# Altium schematic sheet UWB_DWM1000.SchDoc
size A4
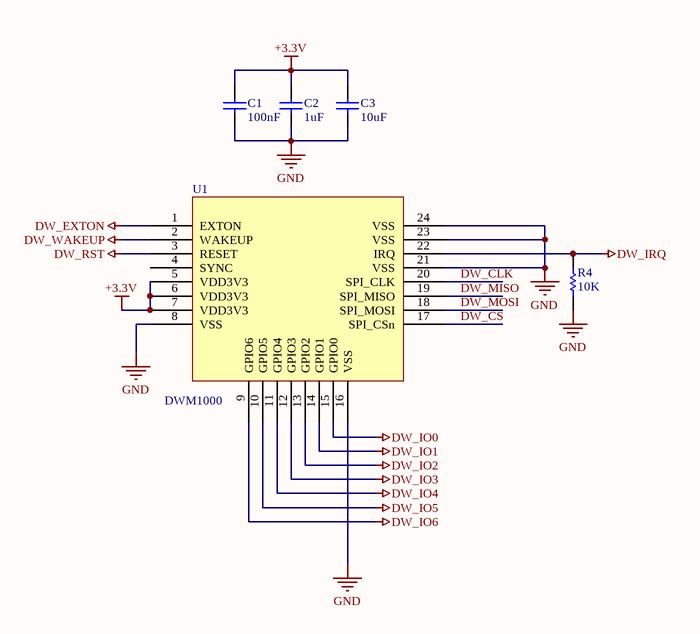
[diagram p0: UWB_DWM1000.SchDoc]

## Parts
C1  value 100nF  [CAPC1608N]  (hidden comment: Cap)
C2  value 1uF  [CAPC1608N]  (hidden comment: Cap)
C3  value 10uF  [CAPC1608N]  (hidden comment: Cap)
R4  value 10K  [RESC1608N]  (hidden comment: Res1)
U1  DWM1000  [DWM1000]

## Nets
+3.3V: C1.1 C2.1 C3.1 U1.5(VDD3V3) U1.6(VDD3V3) U1.7(VDD3V3)
DW_EXTON: U1.1(EXTON)
DW_IO0: U1.15(GPIO0)
DW_IO1: U1.14(GPIO1)
DW_IO2: U1.13(GPIO2)
DW_IO3: U1.12(GPIO3)
DW_IO4: U1.11(GPIO4)
DW_IO5: U1.10(GPIO5)
DW_IO6: U1.9(GPIO6)
DW_IRQ: R4.2 U1.22(IRQ)
DW_RST: U1.3(RESET)
DW_WAKEUP: U1.2(WAKEUP)
GND: C1.2 C2.2 C3.2 R4.1 U1.8(VSS) U1.16(VSS) U1.21(VSS) U1.23(VSS) U1.24(VSS)
DW_CLK: U1.20(SPI_CLK)
DW_CS: U1.17(SPI_CSn)
DW_MISO: U1.19(SPI_MISO)
DW_MOSI: U1.18(SPI_MOSI)

Not connected (* = marked no-connect by the designer): U1 4(SYNC)

## Library data of the parts
C1-C3 = Cap: Capacitor; Published: 8-Jun-2000; LatestRevisionDate: 17-Jul-2002; LatestRevisionNote: Re-released for DXP Platform.; PackageReference: RAD-0.3; Publisher: Altium Limited
R4 = Res1: Resistor; Published: 8-Jun-2000; LatestRevisionDate: 17-Jul-2002; LatestRevisionNote: Re-released for DXP Platform.; PackageReference: AXIAL-0.3; Publisher: Altium Limited
U1 = DWM1000: MOD IEEE802.15.4-2011 UWB TXRX; Manufacturer: Decawave Limited; Frequency: 3.5GHz ~ 6.5GHz; Data Rate: 6.8Mbps; Serial Interfaces: SPI; Antenna Type: Integrated, Chip; Voltage - Supply: 2.8 V ~ 3.6 V; Current - Receiving: 64mA; Current - Transmitting: 31mA; Supplier 1: Digi-Key; Manufacturer Part Number: DWM1000; RoHS: RoHS Compliant; Category: RF/IF and RFID; Stock 1: 1028; Pricing 1: 1=32.16, 10=26.704, 100=24.24, 250=22.51296 (USD); Packaging: Cut Tape (CT); RF Family/Standard: 802.15.4; Protocol: -; Modulation: -; Power - Output: -; Sensitivity: -; Memory Size: -; Mounting Type: Surface Mount; Operating Temperature: -40°C ~ 85°C; Package / Case: Module; ComponentLink1URL: http://www.decawave.com/sites/default/files/product-pdf/dwm1000-product-brief.pdf; ComponentLink1Description: http://www.decawave.com/sites/default/files/product-pdf/dwm1000-product-brief.pdf; Supplier Part Number 1: 1479-1002-1-ND